# Altium project DIOT_Kasli_Adapter.PrjPCB (part 1 of 4)
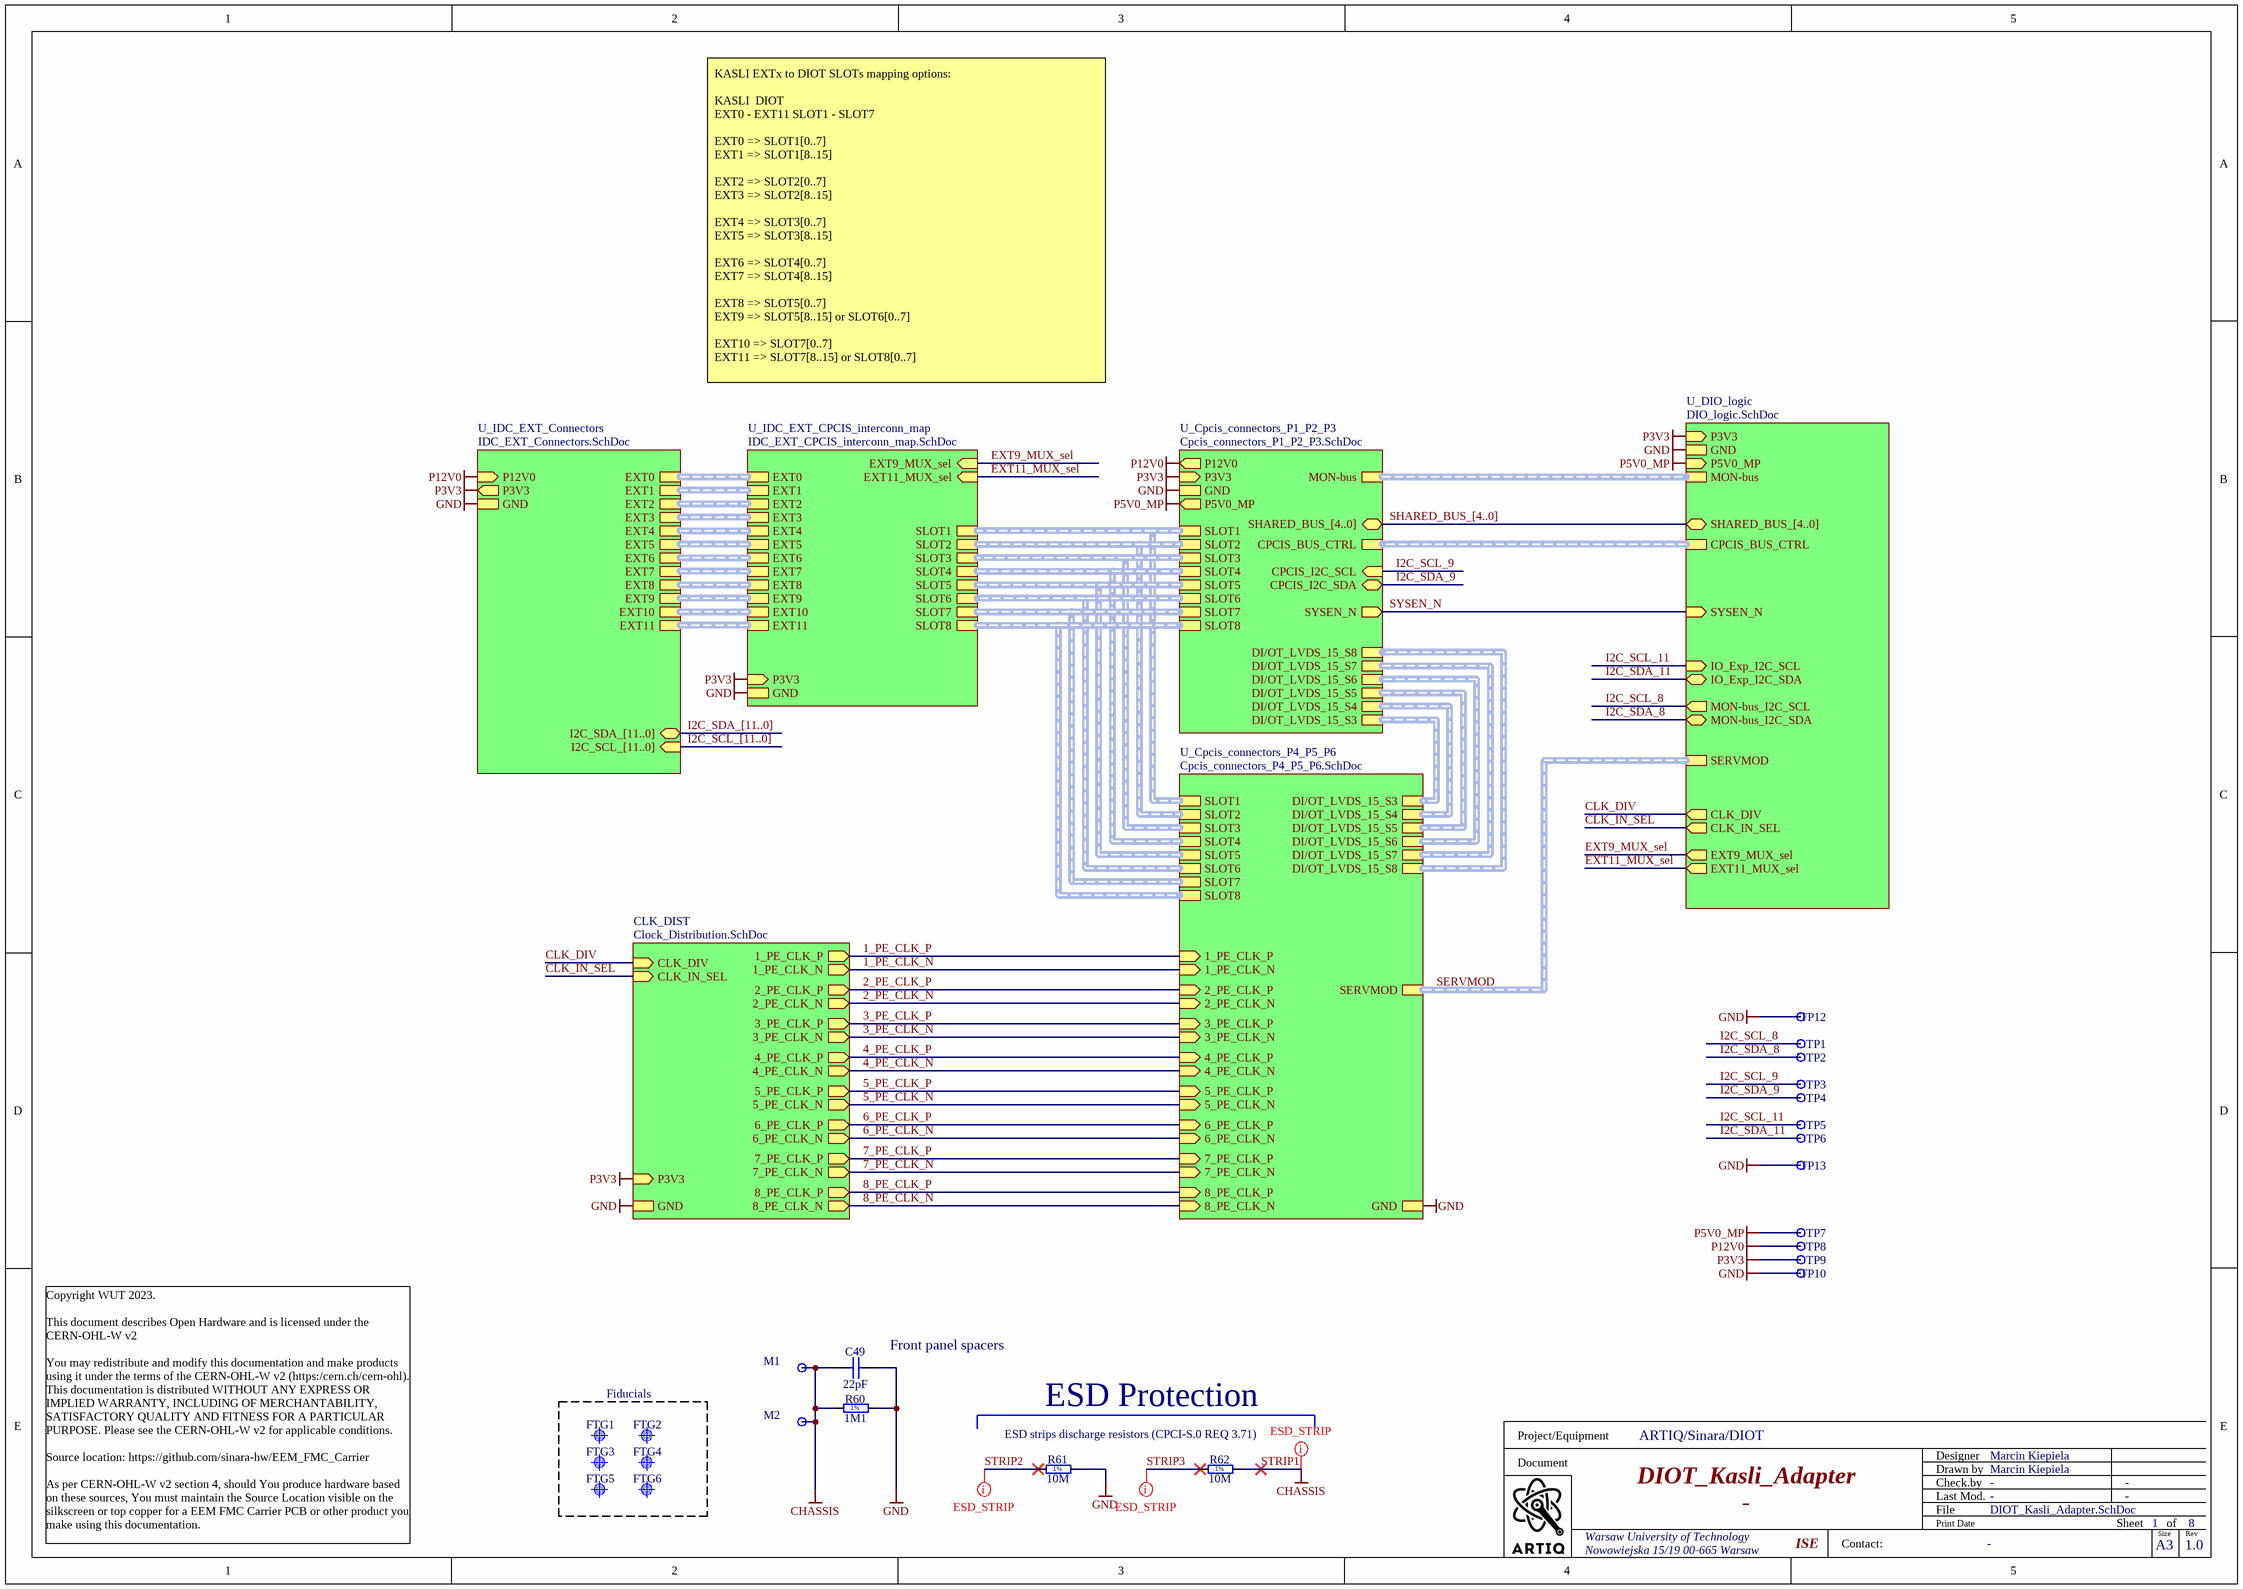
[diagram p0: DIOT_Kasli_Adapter.SchDoc]
Address1: Warsaw University of Technology; Address2: Nowowiejska 15/19 00-665 Warsaw; Address3: -; CheckedBy: -; CheckedDate: -; Designer: Marcin Kiepiela; DivGrp: ISE; DrawnBy: Marcin Kiepiela; Project1: DIOT_Kasli_Adapter; Projet: ARTIQ/Sinara/DIOT; SheetTotal: 8; Title: DIOT_Kasli_Adapter; Version: 1.0
8 sheets, 171 parts. Net scope: strictly hierarchical (ports join the sheet entries above them; power ports are local).
Board file: DIOT_Kasli_Adapter.PcbDoc
Sheets:
  DIOT_Kasli_Adapter.SchDoc
    U_Cpcis_connectors_P1_P2_P3 = Cpcis_connectors_P1_P2_P3.SchDoc
    U_Cpcis_connectors_P4_P5_P6 = Cpcis_connectors_P4_P5_P6.SchDoc
    U_IDC_EXT_Connectors = IDC_EXT_Connectors.SchDoc
    CLK_DIST = Clock_Distribution.SchDoc
    U_IDC_EXT_CPCIS_interconn_map = IDC_EXT_CPCIS_interconn_map.SchDoc
      U_MUX_EEM_EXT = MUX_EEM_EXT.SchDoc
    U_DIO_logic = DIO_logic.SchDoc

## Sheet DIOT_Kasli_Adapter.SchDoc: DIOT_Kasli_Adapter
size 420 x 297 mm; CheckedBy: -; DrawnBy: Marcin Kiepiela; Address1: Warsaw University of Technology; Address2: Nowowiejska 15/19 00-665 Warsaw; DocumentNumber: 1; SheetNumber: 1; SheetTotal: 8; EDA_Number: ARTIQ; Projet: ARTIQ/Sinara/DIOT; ModifiedBy: -; CheckedDate: -; Title2: -; DivGrp: ISE; Designer: Marcin Kiepiela; ModifiedDate: -; ProjectName: DIOT_Kasli_Adapter.PrjPCB

### Parts
C49  22pF  [CAPC1005X55N]
FTG1  Use only in PCB  [FIDUCIAL_TOP_S100-200]  (value not drawn)  (no BOM)
FTG2  Use only in PCB  [FIDUCIAL_TOP_S100-200]  (value not drawn)  (no BOM)
FTG3  Use only in PCB  [FIDUCIAL_TOP_S100-200]  (value not drawn)  (no BOM)
FTG4  Use only in PCB  [FIDUCIAL_TOP_S100-200]  (value not drawn)  (no BOM)
FTG5  Use only in PCB  [FIDUCIAL_TOP_S100-200]  (value not drawn)  (no BOM)
FTG6  Use only in PCB  [FIDUCIAL_TOP_S100-200]  (value not drawn)  (no BOM)
M1  Plated Hole  [MTG300_600]  (value not drawn)  (no BOM)
M2  Plated Hole  [MTG300_600]  (value not drawn)  (no BOM)
R60  1M1  [RESC2012X60N]
R61  10M  [RESC2113X55N]
R62  10M  [RESC2113X55N]
TP1  P3V3  [TPS127]  (value not drawn)  (no BOM)
TP2  P3V3  [TPS127]  (value not drawn)  (no BOM)
TP3  P3V3  [TPS127]  (value not drawn)  (no BOM)
TP4  P3V3  [TPS127]  (value not drawn)  (no BOM)
TP5  P3V3  [TPS127]  (value not drawn)  (no BOM)
TP6  P3V3  [TPS127]  (value not drawn)  (no BOM)
TP7  P3V3  [TPS127]  (value not drawn)  (no BOM)
TP8  P3V3  [TPS127]  (value not drawn)  (no BOM)
TP9  P3V3  [TPS127]  (value not drawn)  (no BOM)
TP10  P3V3  [TPS127]  (value not drawn)  (no BOM)
TP12  P3V3  [TPS127]  (value not drawn)  (no BOM)
TP13  P3V3  [TPS127]  (value not drawn)  (no BOM)

### Blocks framed on the sheet
Fiducials: FTG1-FTG6

### Sub-sheets
CLK_DIST = Clock_Distribution.SchDoc: 1_PE_CLK_P (out), 1_PE_CLK_N (out), 2_PE_CLK_P (out), 2_PE_CLK_N (out), 3_PE_CLK_P (out), 3_PE_CLK_N (out), 4_PE_CLK_P (out), 4_PE_CLK_N (out), 5_PE_CLK_P (out), 5_PE_CLK_N (out), 6_PE_CLK_P (out), 6_PE_CLK_N (out), 7_PE_CLK_P (out), 7_PE_CLK_N (out), 8_PE_CLK_P (out), 8_PE_CLK_N (out), CLK_DIV (in), CLK_IN_SEL (in), P3V3 (in), GND
U_Cpcis_connectors_P1_P2_P3 = Cpcis_connectors_P1_P2_P3.SchDoc: CPCIS_I2C_SCL (in), CPCIS_I2C_SDA (bidir), SLOT7 (harness SLOT), SLOT6 (harness ExtensionConnector), SLOT1 (harness SLOT), SLOT5 (harness SLOT), SLOT2 (harness SLOT), SLOT3 (harness SLOT), SLOT4 (harness SLOT), SLOT8 (harness ExtensionConnector), DI/OT_LVDS_15_S3 (harness LVDS), DI/OT_LVDS_15_S4 (harness LVDS), DI/OT_LVDS_15_S5 (harness LVDS), DI/OT_LVDS_15_S6 (harness LVDS), DI/OT_LVDS_15_S7 (harness LVDS), DI/OT_LVDS_15_S8 (harness LVDS), SHARED_BUS_[4..0] (bidir), GND, P12V0 (out), CPCIS_BUS_CTRL (harness CPCIS_BUS_CTRL), P3V3 (in), SYSEN_N (out), MON-bus (harness MON-bus), P5V0_MP (out)
U_Cpcis_connectors_P4_P5_P6 = Cpcis_connectors_P4_P5_P6.SchDoc: 1_PE_CLK_P (in), 1_PE_CLK_N (in), 2_PE_CLK_P (in), 2_PE_CLK_N (in), 3_PE_CLK_P (in), 3_PE_CLK_N (in), 4_PE_CLK_P (in), 4_PE_CLK_N (in), 5_PE_CLK_P (in), 5_PE_CLK_N (in), 6_PE_CLK_P (in), 6_PE_CLK_N (in), 7_PE_CLK_P (in), 7_PE_CLK_N (in), 8_PE_CLK_P (in), 8_PE_CLK_N (in), SLOT8 (harness ExtensionConnector), SLOT5 (harness SLOT), SLOT1 (harness SLOT), SLOT3 (harness SLOT), SLOT6 (harness ExtensionConnector), SLOT2 (harness SLOT), SLOT7 (harness SLOT), SLOT4 (harness SLOT), DI/OT_LVDS_15_S3 (harness LVDS), DI/OT_LVDS_15_S4 (harness LVDS), DI/OT_LVDS_15_S5 (harness LVDS), DI/OT_LVDS_15_S6 (harness LVDS), DI/OT_LVDS_15_S7 (harness LVDS), DI/OT_LVDS_15_S8 (harness LVDS), SERVMOD (harness SERVMOD), GND
U_DIO_logic = DIO_logic.SchDoc: CPCIS_BUS_CTRL (harness CPCIS_BUS_CTRL), MON-bus (harness MON-bus), GND, P3V3 (in), SYSEN_N (in), SERVMOD (harness SERVMOD), SHARED_BUS_[4..0] (bidir), IO_Exp_I2C_SCL (in), IO_Exp_I2C_SDA (bidir), P5V0_MP (in), MON-bus_I2C_SCL (out), MON-bus_I2C_SDA (bidir), CLK_DIV (out), CLK_IN_SEL (out), EXT9_MUX_sel (out), EXT11_MUX_sel (out)
U_IDC_EXT_Connectors = IDC_EXT_Connectors.SchDoc: EXT0 (harness ExtensionConnector), EXT2 (harness ExtensionConnector), EXT4 (harness ExtensionConnector), EXT5 (harness ExtensionConnector), EXT6 (harness ExtensionConnector), EXT7 (harness ExtensionConnector), I2C_SDA_[11..0] (bidir), I2C_SCL_[11..0] (in), EXT3 (harness ExtensionConnector), EXT1 (harness ExtensionConnector), EXT8 (harness ExtensionConnector), EXT9 (harness ExtensionConnector), EXT10 (harness ExtensionConnector), EXT11 (harness ExtensionConnector), GND, P3V3 (out), P12V0 (in)
U_IDC_EXT_CPCIS_interconn_map = IDC_EXT_CPCIS_interconn_map.SchDoc: EXT0 (harness ExtensionConnector), EXT2 (harness ExtensionConnector), EXT4 (harness ExtensionConnector), EXT5 (harness ExtensionConnector), EXT6 (harness ExtensionConnector), EXT7 (harness ExtensionConnector), EXT3 (harness ExtensionConnector), EXT1 (harness ExtensionConnector), EXT8 (harness ExtensionConnector), EXT9 (harness ExtensionConnector), EXT10 (harness ExtensionConnector), EXT11 (harness ExtensionConnector), SLOT2 (harness SLOT), SLOT3 (harness SLOT), SLOT1 (harness SLOT), SLOT4 (harness SLOT), SLOT5 (harness SLOT), SLOT6 (harness ExtensionConnector), SLOT8 (harness ExtensionConnector), SLOT7 (harness SLOT), GND, P3V3 (in), EXT9_MUX_sel (in), EXT11_MUX_sel (in)

### Nets
CHASSIS: C49.1 M1.1 M2.1 R60.1 R62.2  [also labelled STRIP1]
GND: C49.2 R60.2 R61.2 TP10.1 TP12.1 TP13.1 ; sheet U_Cpcis_connectors_P1_P2_P3/GND, sheet U_Cpcis_connectors_P4_P5_P6/GND, sheet U_IDC_EXT_Connectors/GND, sheet CLK_DIST/GND, sheet U_IDC_EXT_CPCIS_interconn_map/GND, sheet U_DIO_logic/GND
P3V3: TP9.1 ; sheet U_Cpcis_connectors_P1_P2_P3/P3V3, sheet U_IDC_EXT_Connectors/P3V3, sheet CLK_DIST/P3V3, sheet U_IDC_EXT_CPCIS_interconn_map/P3V3, sheet U_DIO_logic/P3V3
P5V0_MP: TP7.1 ; sheet U_Cpcis_connectors_P1_P2_P3/P5V0_MP, sheet U_DIO_logic/P5V0_MP
P12V0: TP8.1 ; sheet U_Cpcis_connectors_P1_P2_P3/P12V0, sheet U_IDC_EXT_Connectors/P12V0
1_PE_CLK_N: sheet U_Cpcis_connectors_P4_P5_P6/1_PE_CLK_N, sheet CLK_DIST/1_PE_CLK_N
1_PE_CLK_P: sheet U_Cpcis_connectors_P4_P5_P6/1_PE_CLK_P, sheet CLK_DIST/1_PE_CLK_P
2_PE_CLK_N: sheet U_Cpcis_connectors_P4_P5_P6/2_PE_CLK_N, sheet CLK_DIST/2_PE_CLK_N
2_PE_CLK_P: sheet U_Cpcis_connectors_P4_P5_P6/2_PE_CLK_P, sheet CLK_DIST/2_PE_CLK_P
3_PE_CLK_N: sheet U_Cpcis_connectors_P4_P5_P6/3_PE_CLK_N, sheet CLK_DIST/3_PE_CLK_N
3_PE_CLK_P: sheet U_Cpcis_connectors_P4_P5_P6/3_PE_CLK_P, sheet CLK_DIST/3_PE_CLK_P
4_PE_CLK_N: sheet U_Cpcis_connectors_P4_P5_P6/4_PE_CLK_N, sheet CLK_DIST/4_PE_CLK_N
4_PE_CLK_P: sheet U_Cpcis_connectors_P4_P5_P6/4_PE_CLK_P, sheet CLK_DIST/4_PE_CLK_P
5_PE_CLK_N: sheet U_Cpcis_connectors_P4_P5_P6/5_PE_CLK_N, sheet CLK_DIST/5_PE_CLK_N
5_PE_CLK_P: sheet U_Cpcis_connectors_P4_P5_P6/5_PE_CLK_P, sheet CLK_DIST/5_PE_CLK_P
6_PE_CLK_N: sheet U_Cpcis_connectors_P4_P5_P6/6_PE_CLK_N, sheet CLK_DIST/6_PE_CLK_N
6_PE_CLK_P: sheet U_Cpcis_connectors_P4_P5_P6/6_PE_CLK_P, sheet CLK_DIST/6_PE_CLK_P
7_PE_CLK_N: sheet U_Cpcis_connectors_P4_P5_P6/7_PE_CLK_N, sheet CLK_DIST/7_PE_CLK_N
7_PE_CLK_P: sheet U_Cpcis_connectors_P4_P5_P6/7_PE_CLK_P, sheet CLK_DIST/7_PE_CLK_P
8_PE_CLK_N: sheet U_Cpcis_connectors_P4_P5_P6/8_PE_CLK_N, sheet CLK_DIST/8_PE_CLK_N
8_PE_CLK_P: sheet U_Cpcis_connectors_P4_P5_P6/8_PE_CLK_P, sheet CLK_DIST/8_PE_CLK_P
CLK_DIV: sheet CLK_DIST/CLK_DIV, sheet U_DIO_logic/CLK_DIV
CLK_IN_SEL: sheet CLK_DIST/CLK_IN_SEL, sheet U_DIO_logic/CLK_IN_SEL
EXT9_MUX_sel: sheet U_IDC_EXT_CPCIS_interconn_map/EXT9_MUX_sel, sheet U_DIO_logic/EXT9_MUX_sel
EXT11_MUX_sel: sheet U_IDC_EXT_CPCIS_interconn_map/EXT11_MUX_sel, sheet U_DIO_logic/EXT11_MUX_sel
I2C_SCL_8: TP1.1 ; sheet U_DIO_logic/MON-bus_I2C_SCL
I2C_SCL_9: TP3.1 ; sheet U_Cpcis_connectors_P1_P2_P3/CPCIS_I2C_SCL
I2C_SCL_11: TP5.1 ; sheet U_DIO_logic/IO_Exp_I2C_SCL
I2C_SDA_8: TP2.1 ; sheet U_DIO_logic/MON-bus_I2C_SDA
I2C_SDA_9: TP4.1 ; sheet U_Cpcis_connectors_P1_P2_P3/CPCIS_I2C_SDA
I2C_SDA_11: TP6.1 ; sheet U_DIO_logic/IO_Exp_I2C_SDA
STRIP2: R61.1  [project net STRIP2_1]
STRIP3: R62.1  [project net STRIP3_1]
SYSEN_N: sheet U_Cpcis_connectors_P1_P2_P3/SYSEN_N, sheet U_DIO_logic/SYSEN_N

### Buses and harness runs
bus I2C_SCL_[11..0] = sheet U_IDC_EXT_Connectors/I2C_SCL_[11..0]
bus I2C_SDA_[11..0] = sheet U_IDC_EXT_Connectors/I2C_SDA_[11..0]
bus SHARED_BUS_[4..0] = sheet U_Cpcis_connectors_P1_P2_P3/SHARED_BUS_[4..0] = sheet U_DIO_logic/SHARED_BUS_[4..0]
harness SERVMOD = sheet U_Cpcis_connectors_P4_P5_P6/SERVMOD = sheet U_DIO_logic/SERVMOD
harness sheet U_Cpcis_connectors_P1_P2_P3/CPCIS_BUS_CTRL = sheet U_DIO_logic/CPCIS_BUS_CTRL
harness sheet U_Cpcis_connectors_P1_P2_P3/DI/OT_LVDS_15_S3 = sheet U_Cpcis_connectors_P4_P5_P6/DI/OT_LVDS_15_S3
harness sheet U_Cpcis_connectors_P1_P2_P3/DI/OT_LVDS_15_S4 = sheet U_Cpcis_connectors_P4_P5_P6/DI/OT_LVDS_15_S4
harness sheet U_Cpcis_connectors_P1_P2_P3/DI/OT_LVDS_15_S5 = sheet U_Cpcis_connectors_P4_P5_P6/DI/OT_LVDS_15_S5
harness sheet U_Cpcis_connectors_P1_P2_P3/DI/OT_LVDS_15_S6 = sheet U_Cpcis_connectors_P4_P5_P6/DI/OT_LVDS_15_S6
harness sheet U_Cpcis_connectors_P1_P2_P3/DI/OT_LVDS_15_S7 = sheet U_Cpcis_connectors_P4_P5_P6/DI/OT_LVDS_15_S7
harness sheet U_Cpcis_connectors_P1_P2_P3/DI/OT_LVDS_15_S8 = sheet U_Cpcis_connectors_P4_P5_P6/DI/OT_LVDS_15_S8
harness sheet U_Cpcis_connectors_P1_P2_P3/MON-bus = sheet U_DIO_logic/MON-bus
harness sheet U_Cpcis_connectors_P1_P2_P3/SLOT1 = sheet U_Cpcis_connectors_P4_P5_P6/SLOT1 = sheet U_IDC_EXT_CPCIS_interconn_map/SLOT1
harness sheet U_Cpcis_connectors_P1_P2_P3/SLOT2 = sheet U_Cpcis_connectors_P4_P5_P6/SLOT2 = sheet U_IDC_EXT_CPCIS_interconn_map/SLOT2
harness sheet U_Cpcis_connectors_P1_P2_P3/SLOT3 = sheet U_Cpcis_connectors_P4_P5_P6/SLOT3 = sheet U_IDC_EXT_CPCIS_interconn_map/SLOT3
harness sheet U_Cpcis_connectors_P1_P2_P3/SLOT4 = sheet U_Cpcis_connectors_P4_P5_P6/SLOT4 = sheet U_IDC_EXT_CPCIS_interconn_map/SLOT4
harness sheet U_Cpcis_connectors_P1_P2_P3/SLOT5 = sheet U_Cpcis_connectors_P4_P5_P6/SLOT5 = sheet U_IDC_EXT_CPCIS_interconn_map/SLOT5
harness sheet U_Cpcis_connectors_P1_P2_P3/SLOT6 = sheet U_Cpcis_connectors_P4_P5_P6/SLOT6 = sheet U_IDC_EXT_CPCIS_interconn_map/SLOT6
harness sheet U_Cpcis_connectors_P1_P2_P3/SLOT7 = sheet U_Cpcis_connectors_P4_P5_P6/SLOT7 = sheet U_IDC_EXT_CPCIS_interconn_map/SLOT7
harness sheet U_Cpcis_connectors_P1_P2_P3/SLOT8 = sheet U_Cpcis_connectors_P4_P5_P6/SLOT8 = sheet U_IDC_EXT_CPCIS_interconn_map/SLOT8
harness sheet U_IDC_EXT_Connectors/EXT0 = sheet U_IDC_EXT_CPCIS_interconn_map/EXT0
harness sheet U_IDC_EXT_Connectors/EXT1 = sheet U_IDC_EXT_CPCIS_interconn_map/EXT1
harness sheet U_IDC_EXT_Connectors/EXT2 = sheet U_IDC_EXT_CPCIS_interconn_map/EXT2
harness sheet U_IDC_EXT_Connectors/EXT3 = sheet U_IDC_EXT_CPCIS_interconn_map/EXT3
harness sheet U_IDC_EXT_Connectors/EXT4 = sheet U_IDC_EXT_CPCIS_interconn_map/EXT4
harness sheet U_IDC_EXT_Connectors/EXT5 = sheet U_IDC_EXT_CPCIS_interconn_map/EXT5
harness sheet U_IDC_EXT_Connectors/EXT6 = sheet U_IDC_EXT_CPCIS_interconn_map/EXT6
harness sheet U_IDC_EXT_Connectors/EXT7 = sheet U_IDC_EXT_CPCIS_interconn_map/EXT7
harness sheet U_IDC_EXT_Connectors/EXT8 = sheet U_IDC_EXT_CPCIS_interconn_map/EXT8
harness sheet U_IDC_EXT_Connectors/EXT9 = sheet U_IDC_EXT_CPCIS_interconn_map/EXT9
harness sheet U_IDC_EXT_Connectors/EXT10 = sheet U_IDC_EXT_CPCIS_interconn_map/EXT10
harness sheet U_IDC_EXT_Connectors/EXT11 = sheet U_IDC_EXT_CPCIS_interconn_map/EXT11

### Layout directives
net class ESD_STRIP: CHASSIS, STRIP2_1, STRIP3_1

### Notes on the sheet
- KASLI EXTx to DIOT SLOTs mapping options:
  KASLI		DIOT
  EXT0 - EXT11	SLOT1 - SLOT7
  EXT0	=>	SLOT1[0..7]
  EXT1	=>	SLOT1[8..15]
  EXT2	=>	SLOT2[0..7]
  EXT3	=>	SLOT2[8..15]
  EXT4	=>	SLOT3[0..7]
  EXT5	=>	SLOT3[8..15]
  EXT6	=>	SLOT4[0..7]
  EXT7	=>	SLOT4[8..15]
  EXT8	=>	SLOT5[0..7]
  EXT9	=>	SLOT5[8..15]	or	SLOT6[0..7]
  EXT10	=>	SLOT7[0..7]
  EXT11	=>	SLOT7[8..15]	or	SLOT8[0..7]
- (near C49) Front panel spacers
- ESD strips discharge resistors (CPCI-S.0 REQ 3.71)
- ESD Protection
- Project/Equipment
- Document
- Designer
- Drawn by
- Check.by
- Copyright WUT 2023.
  This document describes Open Hardware and is licensed under the CERN-OHL-W v2
  You may redistribute and modify this documentation and make products using it under the terms of the CERN-OHL-W v2 (https:/cern.ch/cern-ohl). This documentation is distributed WITHOUT ANY EXPRESS OR IMPLIED WARRANTY, INCLUDING OF MERCHANTABILITY, SATISFACTORY QUALITY AND FITNESS FOR A PARTICULAR PURPOSE. Please see the CERN-OHL-W v2 for applicable conditions.
  Source location: https://github.com/sinara-hw/EEM_FMC_Carrier
  As per CERN-OHL-W v2 section 4, should You produce hardware based on these sources, You must maintain the Source Location visible on the silkscreen or top copper for a EEM FMC Carrier PCB or other product you make using this documentation.
- Contact:
- File
- Last Mod.
- Print Date
- Sheet
- Size
- A3
- of
- Rev
- (in symbol R0805_1M1_1%_0.125W_100PPM) 1%
- (in symbol R0805_10M_1%_0.125W_100PPM_VISHAY_CRCW e3) 1%

### Library data of the parts
C49 = CC0402_22PF_50V_5%_C0G: Non-polarised capacitor; Part Description: SMD Multilayer Chip Ceramic Capacitor; Manufacturer: GENERIC; Manufacturer1 Part Number: C0402C220J5GACTU; Voltage: 50V; TC: C0G/NP0; Tolerance: ±5%; Part Number: CC0402_22PF_50V_5%_C0G; Component Kind: Standard; Component Type: Standard; Pin Count: 2; Value: 22pF; Status: Preferred; Manufacturer Part Number: CC0402_22PF_50V_5%_C0G; Case: 0402; Mounted: Yes; Socket: No; SMD: Yes; Manufacturer1 Example: KEMET; Manufacturer1 ComponentHeight: 0.55mm; HelpURL: \\cern.ch\dfs\Applications\Altium\Datasheets\CC0402_C0G_KEMET_(Commercial Grade).pdf; Author: CERN DEM JLC; CreateDate: 2007-12-03; LatestRevisionDate: 2007-12-03; Sense: No
FTG1-FTG6 = FIDUCIAL_TARGET_S100-200: Fiducial Target; Part Description: Square Fiducial Target, Top Layer, 1.0mm, Top Solder 2.0mm, Keepout =2.0mm; Mounted: No; Part Number: FIDUCIAL_TARGET_S100-200; Component Type: Standard (No BOM); Pin Count: 1; Family: Fiducial; Socket: No; SMD: Yes; Status: None; ComponentHeight: 0mm; Author: CERN DEM JLC; CreateDate: 2010-02-09; LatestRevisionDate: 2012-04-04; PackageDescription: Square Fiducial Target, Top Layer, 1.0mm, Top Solder 2.0mm, Keepout =2.0mm; HelpURL: Undefined; Sense: No
M1 M2 = PLATED_HOLE3.0_PAD6.0: Single Terminal Socket; Part Description: Plated Through Hole: Hole Dia.=3.0mm Pad Dia.=6.0mm; Mounted: No; Table: Pads; Part Number: PLATED_HOLE3.0_PAD6.0; Component Type: Standard (No BOM); Designator: Single Terminal Socket; Library Reference: Single Terminal Socket; Pin Count: 1; Family: Plated Hole; Socket: No; SMD: No; Status: None; ComponentHeight: 0mm; Author: CERN DEM JLC; CreateDate: 26.05.2008; LatestRevisionDate: 26.05.2008; PackageDescription: Plated Through Hole: Hole Dia.=3.0mm Pad Dia.=6.0mm
R60 = R0805_1M1_1%_0.125W_100PPM: Resistor - 1%; Part Description: General Purpose Thick Film Chip Resistor; Manufacturer: GENERIC; Manufacturer1 Part Number: NRC10F1104TRF; Power: 0.125W; TC: ±100ppm/°C; PressFit: No; Part Number: R0805_1M1_1%_0.125W_100PPM; Component Kind: Standard; Component Type: Standard; Pin Count: 2; Value: 1M1; Status: Preferred; Tolerance: ±1%; Manufacturer Part Number: R0805_1M1_1%_0.125W_100PPM; Case: 0805; Mounted: Yes; Sense: No; Socket: No; SMD: Yes; Manufacturer1 Example: NIC COMPONENT; Manufacturer1 ComponentHeight: 0.6mm; HelpURL: \\cern.ch\dfs\Applications\Altium\Datasheets\R0805_NIC_NRC.pdf; Author: CERN DEM JLC; CreateDate: 03/12/2007; LatestRevisionDate: 13/03/2008
R61 R62 = R0805_10M_1%_0.125W_100PPM_VISHAY_CRCW e3: Resistor - 1%; Part Description: 150V, Standard Thick Film Chip Resistor; Manufacturer: VISHAY DALE; Manufacturer Part Number: CRCW080510M0FKEA; Power: 0.125W; TC: ±100ppm/°C; PressFit: No; Part Number: R0805_10M_1%_0.125W_100PPM_VISHAY_CRCW e3; Component Kind: Standard; Component Type: Standard; Pin Count: 2; Value: 10M; Status: None; Tolerance: ±1%; Case: 0805; Mounted: Yes; Sense: No; Socket: No; SMD: Yes; ComponentHeight: 0.5mm; HelpURL: \\cern.ch\dfs\Applications\Altium\Datasheets\R0805_VISHAY_CRCW e3.pdf; Author: CERN DEM BC; CreateDate: 2019-11-12; LatestRevisionDate: 2019-11-12
TP1-TP10 TP12 TP13 = SMD_PAD_1.27X1.27MM: Test Point; Part Description: 1.27mm x 1.27mm PCB Copper Area (SMD Test Point); Mounted: No; Part Number: SMD_PAD_1.27X1.27MM; Component Type: Standard (No BOM); Pin Count: 1; Family: Test Point; Socket: No; SMD: Yes; Sense: No; Status: None; ComponentHeight: 0mm; HelpURL: Undefined; Author: CERN DEM JLC; CreateDate: 12.01.2008; LatestRevisionDate: 12.01.2008; PackageDescription: 1.27mm x 1.27mm PCB Copper Area (SMD Test Point)

## Sheet Cpcis_connectors_P1_P2_P3.SchDoc: CPCIS Backplane
size 420 x 297 mm; CheckedBy: A.Paixao; CompanyName: CERN; DrawnBy: G. Daniluk; Engineer: G. Daniluk; Organization: CERN; Address1: European Organization for Nuclear Research; Address2: CH-1211 Genève 23 - Switzerland; DocumentNumber: 18; SheetNumber: 18; SheetTotal: 19; Title2: P1 to P4; DivGrp: BE/CO; Designer: G. Daniluk; EDA_Number: EDA-03828-V1-0; Projet: DIOT Demonstrator System Board (based on C-GEFE v1); ModifiedBy: G. Daniluk; CheckedDate: 18/06/2018; ProjectName: Distributed I/O Tier
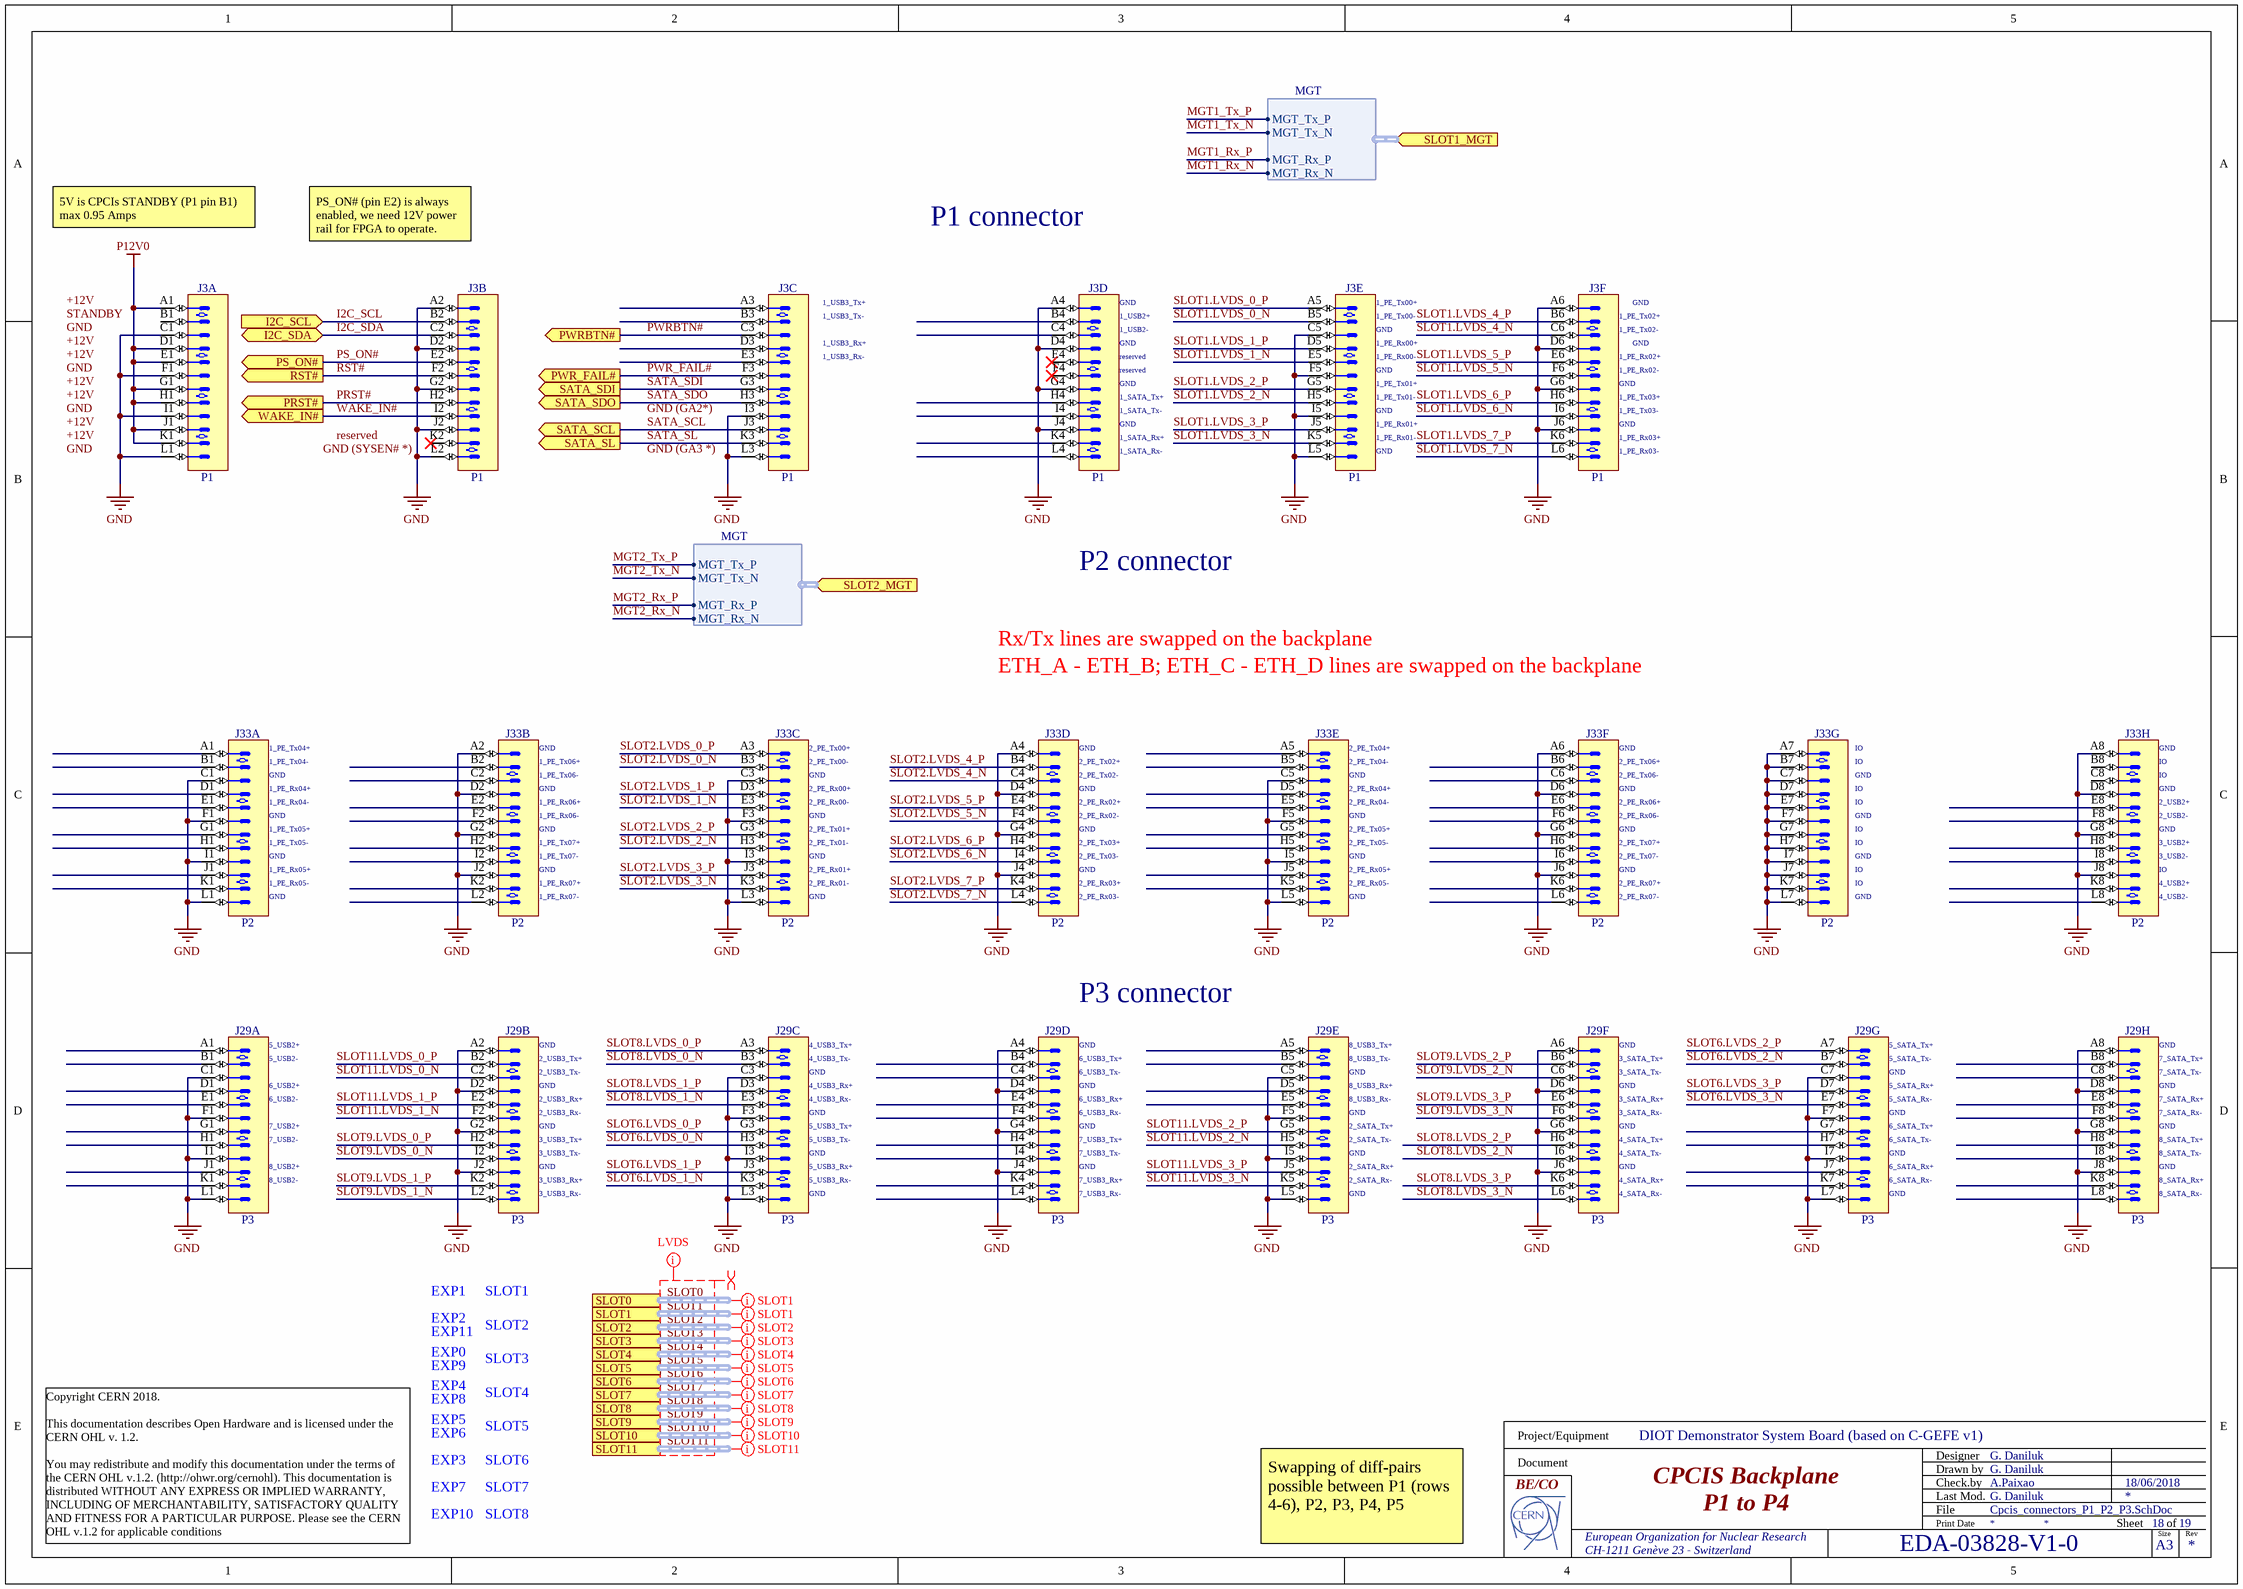
[diagram p1: Cpcis_connectors_P1_P2_P3.SchDoc]

### Parts
J3  P1  [AMPHENOL_10052825-101LF]  (parts A,B,C,D,E,F of 6)
J29  P3  [AMPHENOL_10052837-101LF]  (parts A,B,C,D,E,F,G,H of 8)
J33  P2  [AMPHENOL_10052837-101LF]  (parts A,B,C,D,E,F,G,H of 8)

### Ports
I2C_SCL (in), I2C_SDA (bidir), PRST# (out), PS_ON# (out), PWR_FAIL# (out), PWRBTN# (out), RST# (out), SATA_SCL (out), SATA_SDI (out), SATA_SDO (out), SATA_SL (out), SLOT0 (harness ExtensionConnector), SLOT1 (harness ExtensionConnector), SLOT1_MGT (in, harness MGT), SLOT2 (harness ExtensionConnector), SLOT2_MGT (in, harness MGT), SLOT3 (harness ExtensionConnector), SLOT4 (harness ExtensionConnector), SLOT5 (harness ExtensionConnector), SLOT6 (harness ExtensionConnector), SLOT7 (harness ExtensionConnector), SLOT8 (harness ExtensionConnector), SLOT9 (harness ExtensionConnector), SLOT10 (harness ExtensionConnector), SLOT11 (harness ExtensionConnector), WAKE_IN# (out)

### Harnesses
MGT: MGT_Tx_P, MGT_Tx_N, MGT_Rx_P, MGT_Rx_N

### Nets
GND: J3.A2 J3.A4 J3.A6 J3.C1 J3.C5 J3.D2 J3.D4 J3.D6 J3.F1 J3.F5 J3.G2 J3.G4 J3.G6 J3.I1 J3.I3 J3.I5 J3.J2 J3.J4 J3.J6 J3.L1 J3.L2 J3.L3 J3.L5 J29.A2 J29.A4 J29.A6 J29.A8 J29.C1 J29.C3 J29.C5 J29.C7 J29.D2 J29.D4 J29.D6 J29.D8 J29.F1 J29.F3 J29.F5 J29.F7 J29.G2 J29.G4 J29.G6 J29.G8 J29.I1 J29.I3 J29.I5 J29.I7 J29.J2 J29.J4 J29.J6 J29.J8 J29.L1 J29.L3 J29.L5 J29.L7 J33.A2 J33.A4 J33.A6 J33.A7 J33.A8 J33.B7 J33.C1 J33.C3 J33.C5 J33.C7 J33.D2 J33.D4 J33.D6 J33.D7 J33.D8 J33.E7 J33.F1 J33.F3 J33.F5 J33.F7 J33.G2 J33.G4 J33.G6 J33.G7 J33.G8 J33.H7 J33.I1 J33.I3 J33.I5 J33.I7 J33.J2 J33.J4 J33.J6 J33.J7 J33.J8 J33.K7 J33.L1 J33.L3 J33.L5 J33.L7
P12V0: J3.A1 J3.D1 J3.E1 J3.G1 J3.H1 J3.J1 J3.K1
I2C_SCL: J3.B2 ; port I2C_SCL
I2C_SDA: J3.C2 ; port I2C_SDA
MGT1_Rx_N: port SLOT1_MGT.MGT_Rx_N
MGT1_Rx_P: port SLOT1_MGT.MGT_Rx_P
MGT1_Tx_N: port SLOT1_MGT.MGT_Tx_N
MGT1_Tx_P: port SLOT1_MGT.MGT_Tx_P
MGT2_Rx_N: port SLOT2_MGT.MGT_Rx_N
MGT2_Rx_P: port SLOT2_MGT.MGT_Rx_P
MGT2_Tx_N: port SLOT2_MGT.MGT_Tx_N
MGT2_Tx_P: port SLOT2_MGT.MGT_Tx_P
PRST#: J3.H2 ; port PRST#
PS_ON#: J3.E2 ; port PS_ON#
PWR_FAIL#: J3.F3 ; port PWR_FAIL#
PWRBTN#: J3.C3 ; port PWRBTN#
RST#: J3.F2 ; port RST#
SATA_SCL: J3.J3 ; port SATA_SCL
SATA_SDI: J3.G3 ; port SATA_SDI
SATA_SDO: J3.H3 ; port SATA_SDO
SATA_SL: J3.K3 ; port SATA_SL
SLOT1.LVDS_0_N: J3.B5  [project net SLOT1.LVDS_0_N_18]
SLOT1.LVDS_0_P: J3.A5  [project net SLOT1.LVDS_0_P_18]
SLOT1.LVDS_1_N: J3.E5  [project net SLOT1.LVDS_1_N_18]
SLOT1.LVDS_1_P: J3.D5  [project net SLOT1.LVDS_1_P_18]
SLOT1.LVDS_2_N: J3.H5  [project net SLOT1.LVDS_2_N_18]
SLOT1.LVDS_2_P: J3.G5  [project net SLOT1.LVDS_2_P_18]
SLOT1.LVDS_3_N: J3.K5  [project net SLOT1.LVDS_3_N_18]
SLOT1.LVDS_3_P: J3.J5  [project net SLOT1.LVDS_3_P_18]
SLOT1.LVDS_4_N: J3.C6  [project net SLOT1.LVDS_4_N_18]
SLOT1.LVDS_4_P: J3.B6  [project net SLOT1.LVDS_4_P_18]
SLOT1.LVDS_5_N: J3.F6  [project net SLOT1.LVDS_5_N_18]
SLOT1.LVDS_5_P: J3.E6  [project net SLOT1.LVDS_5_P_18]
SLOT1.LVDS_6_N: J3.I6  [project net SLOT1.LVDS_6_N_18]
SLOT1.LVDS_6_P: J3.H6  [project net SLOT1.LVDS_6_P_18]
SLOT1.LVDS_7_N: J3.L6  [project net SLOT1.LVDS_7_N_18]
SLOT1.LVDS_7_P: J3.K6  [project net SLOT1.LVDS_7_P_18]
SLOT2.LVDS_0_N: J33.B3  [project net SLOT2.LVDS_0_N_18]
SLOT2.LVDS_0_P: J33.A3  [project net SLOT2.LVDS_0_P_18]
SLOT2.LVDS_1_N: J33.E3  [project net SLOT2.LVDS_1_N_18]
SLOT2.LVDS_1_P: J33.D3  [project net SLOT2.LVDS_1_P_18]
SLOT2.LVDS_2_N: J33.H3  [project net SLOT2.LVDS_2_N_18]
SLOT2.LVDS_2_P: J33.G3  [project net SLOT2.LVDS_2_P_18]
SLOT2.LVDS_3_N: J33.K3  [project net SLOT2.LVDS_3_N_18]
SLOT2.LVDS_3_P: J33.J3  [project net SLOT2.LVDS_3_P_18]
SLOT2.LVDS_4_N: J33.C4  [project net SLOT2.LVDS_4_N_18]
SLOT2.LVDS_4_P: J33.B4  [project net SLOT2.LVDS_4_P_18]
SLOT2.LVDS_5_N: J33.F4  [project net SLOT2.LVDS_5_N_18]
SLOT2.LVDS_5_P: J33.E4  [project net SLOT2.LVDS_5_P_18]
SLOT2.LVDS_6_N: J33.I4  [project net SLOT2.LVDS_6_N_18]
SLOT2.LVDS_6_P: J33.H4  [project net SLOT2.LVDS_6_P_18]
SLOT2.LVDS_7_N: J33.L4  [project net SLOT2.LVDS_7_N_18]
SLOT2.LVDS_7_P: J33.K4  [project net SLOT2.LVDS_7_P_18]
SLOT6.LVDS_0_N: J29.H3  [project net SLOT6.LVDS_0_N_18]
SLOT6.LVDS_0_P: J29.G3  [project net SLOT6.LVDS_0_P_18]
SLOT6.LVDS_1_N: J29.K3  [project net SLOT6.LVDS_1_N_18]
SLOT6.LVDS_1_P: J29.J3  [project net SLOT6.LVDS_1_P_18]
SLOT6.LVDS_2_N: J29.B7  [project net SLOT6.LVDS_2_N_18]
SLOT6.LVDS_2_P: J29.A7  [project net SLOT6.LVDS_2_P_18]
SLOT6.LVDS_3_N: J29.E7  [project net SLOT6.LVDS_3_N_18]
SLOT6.LVDS_3_P: J29.D7  [project net SLOT6.LVDS_3_P_18]
SLOT8.LVDS_0_N: J29.B3  [project net SLOT8.LVDS_0_N_18]
SLOT8.LVDS_0_P: J29.A3  [project net SLOT8.LVDS_0_P_18]
SLOT8.LVDS_1_N: J29.E3  [project net SLOT8.LVDS_1_N_18]
SLOT8.LVDS_1_P: J29.D3  [project net SLOT8.LVDS_1_P_18]
SLOT8.LVDS_2_N: J29.I6  [project net SLOT8.LVDS_2_N_18]
SLOT8.LVDS_2_P: J29.H6  [project net SLOT8.LVDS_2_P_18]
SLOT8.LVDS_3_N: J29.L6  [project net SLOT8.LVDS_3_N_18]
SLOT8.LVDS_3_P: J29.K6  [project net SLOT8.LVDS_3_P_18]
SLOT9.LVDS_0_N: J29.I2  [project net SLOT9.LVDS_0_N_18]
SLOT9.LVDS_0_P: J29.H2  [project net SLOT9.LVDS_0_P_18]
SLOT9.LVDS_1_N: J29.L2  [project net SLOT9.LVDS_1_N_18]
SLOT9.LVDS_1_P: J29.K2  [project net SLOT9.LVDS_1_P_18]
SLOT9.LVDS_2_N: J29.C6  [project net SLOT9.LVDS_2_N_18]
SLOT9.LVDS_2_P: J29.B6  [project net SLOT9.LVDS_2_P_18]
SLOT9.LVDS_3_N: J29.F6  [project net SLOT9.LVDS_3_N_18]
SLOT9.LVDS_3_P: J29.E6  [project net SLOT9.LVDS_3_P_18]
SLOT11.LVDS_0_N: J29.C2  [project net SLOT11.LVDS_0_N_18]
SLOT11.LVDS_0_P: J29.B2  [project net SLOT11.LVDS_0_P_18]
SLOT11.LVDS_1_N: J29.F2  [project net SLOT11.LVDS_1_N_18]
SLOT11.LVDS_1_P: J29.E2  [project net SLOT11.LVDS_1_P_18]
SLOT11.LVDS_2_N: J29.H5  [project net SLOT11.LVDS_2_N_18]
SLOT11.LVDS_2_P: J29.G5  [project net SLOT11.LVDS_2_P_18]
SLOT11.LVDS_3_N: J29.K5  [project net SLOT11.LVDS_3_N_18]
SLOT11.LVDS_3_P: J29.J5  [project net SLOT11.LVDS_3_P_18]
WAKE_IN#: J3.I2 ; port WAKE_IN#

Not connected (* = marked no-connect by the designer): J3 A3 B1 B3 B4 C4 D3 E3 E4* F4* H4 I4 K2* K4 L4; J29 A1 A5 B1 B4 B5 B8 C4 C8 D1 D5 E1 E4 E5 E8 F4 F8 G1 G7 H1 H4 H7 H8 I4 I8 J1 J7 K1 K4 K7 K8 L4 L8; J33 A1 A5 B1 B2 B5 B6 B8 C2 C6 C8 D1 D5 E1 E2 E5 E6 E8 F2 F6 F8 G1 G5 H1 H2 H5 H6 H8 I2 I6 I8 J1 J5 K1 K2 K5 K6 K8 L2 L6 L8

### Buses and harness runs
harness SLOT0 = port SLOT0
harness SLOT1 = port SLOT1
harness SLOT2 = port SLOT2
harness SLOT3 = port SLOT3
harness SLOT4 = port SLOT4
harness SLOT5 = port SLOT5
harness SLOT6 = port SLOT6
harness SLOT7 = port SLOT7
harness SLOT8 = port SLOT8
harness SLOT9 = port SLOT9
harness SLOT10 = port SLOT10
harness SLOT11 = port SLOT11

### Layout directives
net class LVDS: SLOT0, SLOT1, SLOT2, SLOT3, SLOT4, SLOT5, SLOT6, SLOT7, SLOT8, SLOT9, SLOT10, SLOT11
net class SLOT1: (no net found under the mark)
net class SLOT2: (no net found under the mark)
net class SLOT3: (no net found under the mark)
net class SLOT4: (no net found under the mark)
net class SLOT5: (no net found under the mark)
net class SLOT6: (no net found under the mark)
net class SLOT7: (no net found under the mark)
net class SLOT8: (no net found under the mark)
differential pair: SLOT0, SLOT1, SLOT2, SLOT3, SLOT4, SLOT5, SLOT6, SLOT7, SLOT8, SLOT9, SLOT10, SLOT11
net class SLOT9: (no net found under the mark)
net class SLOT10: (no net found under the mark)
net class SLOT11: (no net found under the mark)
net class SLOT0: (no net found under the mark)

### Notes on the sheet
- 5V is CPCIs STANDBY (P1 pin B1)
  max 0.95 Amps
- PS_ON# (pin E2) is always enabled, we need 12V power rail for FPGA to operate.
- P1 connector
- 1_USB3_Tx+
- 1_USB3_Tx-
- (near J3) 1_USB2+
- (near J3) GND
- (near J3) 1_PE_Tx00+
- (near J3) 1_PE_Tx00-
- (near J3) 1_PE_Tx02+
- GND
- 1_USB3_Rx+
- 1_USB3_Rx-
- (near J3) 1_USB2-
- (near J3) 1_SATA_Tx+
- (near J3) reserved
- (near J3) 1_PE_Tx01+
- (near J3) 1_PE_Tx01-
- (near J3) 1_PE_Rx00+
- (near J3) 1_PE_Rx00-
- (near J3) 1_PE_Tx02-
- (near J3) 1_PE_Rx02+
- (near J3) 1_PE_Rx02-
- (near J3) 1_PE_Tx03+
- (near J3) 1_SATA_Tx-
- (near J3) 1_SATA_Rx+
- (near J3) 1_SATA_Rx-
- (near J3) 1_PE_Rx01+
- (near J3) 1_PE_Rx01-
- (near J3) 1_PE_Tx03-
- (near J3) 1_PE_Rx03+
- (near J3) 1_PE_Rx03-
- P2 connector
- Rx/Tx lines are swapped on the backplane
- ETH_A - ETH_B; ETH_C - ETH_D lines are swapped on the backplane
- (near J33) 1_PE_Tx04+
- (near J33) 1_PE_Tx04-
- (near J33) GND
- (near J33) 1_PE_Rx04+
- (near J33) 1_PE_Rx04-
- (near J33) 1_PE_Tx06+
- (near J33) 1_PE_Tx06-
- (near J33) 1_PE_Rx06+
- (near J33) 2_PE_Tx00+
- (near J33) 2_PE_Tx00-
- (near J33) 2_PE_Rx00+
- (near J33) 2_PE_Rx00-
- (near J33) 2_PE_Tx02+
- (near J33) 2_PE_Tx02-
- (near J33) 2_PE_Rx02+
- (near J33) 2_PE_Tx04+
- (near J33) 2_PE_Tx04-
- (near J33) 2_PE_Rx04+
- (near J33) 2_PE_Rx04-
- (near J33) 2_PE_Tx06+
- (near J33) 2_PE_Tx06-
- (near J33) 2_PE_Rx06+
- (near J33) IO
- (near J33) 2_USB2+
- (near J33) 1_PE_Tx05+
- (near J33) 1_PE_Tx05-
- (near J33) 1_PE_Rx06-
- (near J33) 1_PE_Tx07+
- (near J33) 1_PE_Tx07-
- (near J33) 2_PE_Tx01+
- (near J33) 2_PE_Tx01-
- (near J33) 2_PE_Rx02-
- (near J33) 2_PE_Tx03+
- (near J33) 2_PE_Tx03-
- (near J33) 2_PE_Tx05+
- (near J33) 2_PE_Tx05-
- (near J33) 2_PE_Rx06-
- (near J33) 2_PE_Tx07+
- (near J33) 2_PE_Tx07-
- (near J33) 2_USB2-
- (near J33) 3_USB2+
- (near J33) 3_USB2-
- (near J33) 1_PE_Rx05+
- (near J33) 1_PE_Rx05-
- (near J33) 1_PE_Rx07+
- (near J33) 1_PE_Rx07-
- (near J33) 2_PE_Rx01+
- (near J33) 2_PE_Rx01-
- (near J33) 2_PE_Rx03+
- (near J33) 2_PE_Rx03-
- (near J33) 2_PE_Rx05+
- (near J33) 2_PE_Rx05-
- (near J33) 2_PE_Rx07+
- (near J33) 2_PE_Rx07-
- (near J33) 4_USB2+
- (near J33) 4_USB2-
- (near J29) 5_USB2+
- (near J29) 5_USB2-
- (near J29) GND
- (near J29) 2_USB3_Tx+
- (near J29) 2_USB3_Tx-
- (near J29) 4_USB3_Tx+
- (near J29) 4_USB3_Tx-
- P3 connector
- (near J29) 6_USB3_Tx+
- (near J29) 6_USB3_Tx-
- (near J29) 8_USB3_Tx+
- (near J29) 8_USB3_Tx-
- (near J29) 3_SATA_Tx+
- (near J29) 3_SATA_Tx-
- (near J29) 5_SATA_Tx+
- (near J29) 5_SATA_Tx-
- (near J29) 7_SATA_Tx+
- (near J29) 7_SATA_Tx-
- (near J29) 6_USB2+
- (near J29) 6_USB2-
- (near J29) 7_USB2+
- (near J29) 2_USB3_Rx+
- (near J29) 2_USB3_Rx-
- (near J29) 4_USB3_Rx+
- (near J29) 4_USB3_Rx-
- (near J29) 5_USB3_Tx+
- (near J29) 6_USB3_Rx+
- (near J29) 6_USB3_Rx-
- (near J29) 8_USB3_Rx+
- (near J29) 8_USB3_Rx-
- (near J29) 2_SATA_Tx+
- (near J29) 3_SATA_Rx+
- (near J29) 3_SATA_Rx-
- (near J29) 5_SATA_Rx+
- (near J29) 5_SATA_Rx-
- (near J29) 6_SATA_Tx+
- (near J29) 7_SATA_Rx+
- (near J29) 7_SATA_Rx-
- (near J29) 7_USB2-
- (near J29) 8_USB2+
- (near J29) 8_USB2-
- (near J29) 3_USB3_Tx+
- (near J29) 3_USB3_Tx-
- (near J29) 3_USB3_Rx+
- (near J29) 3_USB3_Rx-
- (near J29) 5_USB3_Tx-
- (near J29) 5_USB3_Rx+
- (near J29) 5_USB3_Rx-
- (near J29) 7_USB3_Tx+
- (near J29) 7_USB3_Tx-
- (near J29) 7_USB3_Rx+
- (near J29) 7_USB3_Rx-
- (near J29) 2_SATA_Tx-
- (near J29) 2_SATA_Rx+
- (near J29) 2_SATA_Rx-
- (near J29) 4_SATA_Tx+
- (near J29) 4_SATA_Tx-
- (near J29) 4_SATA_Rx+
- (near J29) 4_SATA_Rx-
- (near J29) 6_SATA_Tx-
- (near J29) 6_SATA_Rx+
- (near J29) 6_SATA_Rx-
- (near J29) 8_SATA_Tx+
- (near J29) 8_SATA_Tx-
- (near J29) 8_SATA_Rx+
- (near J29) 8_SATA_Rx-
- EXP1
- EXP2
- EXP11
- SLOT1
- SLOT2
- EXP4
- EXP8
- EXP9
- EXP0
- SLOT3
- SLOT4
- EXP3
- EXP5
- EXP6
- SLOT5
- SLOT6
- Copyright CERN 2018.
  This documentation describes Open Hardware and is licensed under the CERN OHL v. 1.2.
  You may redistribute and modify this documentation under the terms of the CERN OHL v.1.2. (http://ohwr.org/cernohl). This documentation is distributed WITHOUT ANY EXPRESS OR IMPLIED WARRANTY, INCLUDING OF MERCHANTABILITY, SATISFACTORY QUALITY AND FITNESS FOR A PARTICULAR PURPOSE. Please see the CERN OHL v.1.2 for applicable conditions
- EXP7
- EXP10
- SLOT7
- SLOT8
- Swapping of diff-pairs possible between P1 (rows 4-6), P2, P3, P4, P5
- Labels drawn without touching a wire or pin: +12V, GND, GND (GA2*), GND (GA3 *), GND (SYSEN# *), reserved, STANDBY
- Project/Equipment
- Document
- Designer
- Drawn by
- Check.by
- File
- Last Mod.
- Print Date
- Sheet
- Size
- A3
- of
- Rev

### Library data of the parts
J3 = AMPHENOL_10052825-101LF: 72 Contacts Header, 6 Columns, 4 Pairs per Column; Part Description: 72 Contacts, 2mm Pitch, 6 Columns, 4 Pairs per Column, 4 Walls, Right Angle Header; Part Number: AMPHENOL_10052825-101LF; Component Kind: Standard; Component Type: Standard; Pin Count: 72; Family: AirMax VS; Mounted: Yes; Socket: No; SMD: No; PressFit: Yes; Sense: No; Status: None; Manufacturer: AMPHENOL; Manufacturer Part Number: 10052825-101LF; ComponentHeight: 15.35mm; HelpURL: \\cern.ch\dfs\Applications\Altium\Datasheets\AMPHENOL_10052825-101LF.pdf; ComponentLink1URL: \\cern.ch\dfs\Applications\Altium\Datasheets\AMPHENOL_10052825-101LF_Application.pdf; ComponentLink1Description: Application; Author: CERN DEM MR; CreateDate: 19/02/2018; LatestRevisionDate: 19/02/2018; Classname: Overlapping
J29 J33 = AMPHENOL_10052837-101LF: 96 Contacts Header, 8 Columns, 4 Pairs per Column; Part Description: 96 Contacts, 2mm Pitch, 8 Columns, 4 Pairs per Column, 2 Walls, Right Angle Header; Part Number: AMPHENOL_10052837-101LF; Component Kind: Standard; Component Type: Standard; Pin Count: 96; Family: AirMax VS; Mounted: Yes; Socket: No; SMD: No; PressFit: Yes; Sense: No; Status: None; Manufacturer: AMPHENOL; Manufacturer Part Number: 10052837-101LF; ComponentHeight: 15.35mm; HelpURL: \\cern.ch\dfs\Applications\Altium\Datasheets\AMPHENOL_10052837-101LF.pdf; ComponentLink1URL: \\cern.ch\dfs\Applications\Altium\Datasheets\AMPHENOL_10052837-101LF_Application.pdf; ComponentLink1Description: Application; Author: CERN DEM MR; CreateDate: 19/02/2018; LatestRevisionDate: 19/02/2018